# Altium schematic sheet Motor-E1.SchDoc: Motor-E1
size Letter; DocumentNumber: 3; SheetNumber: 8; SheetTotal: 11
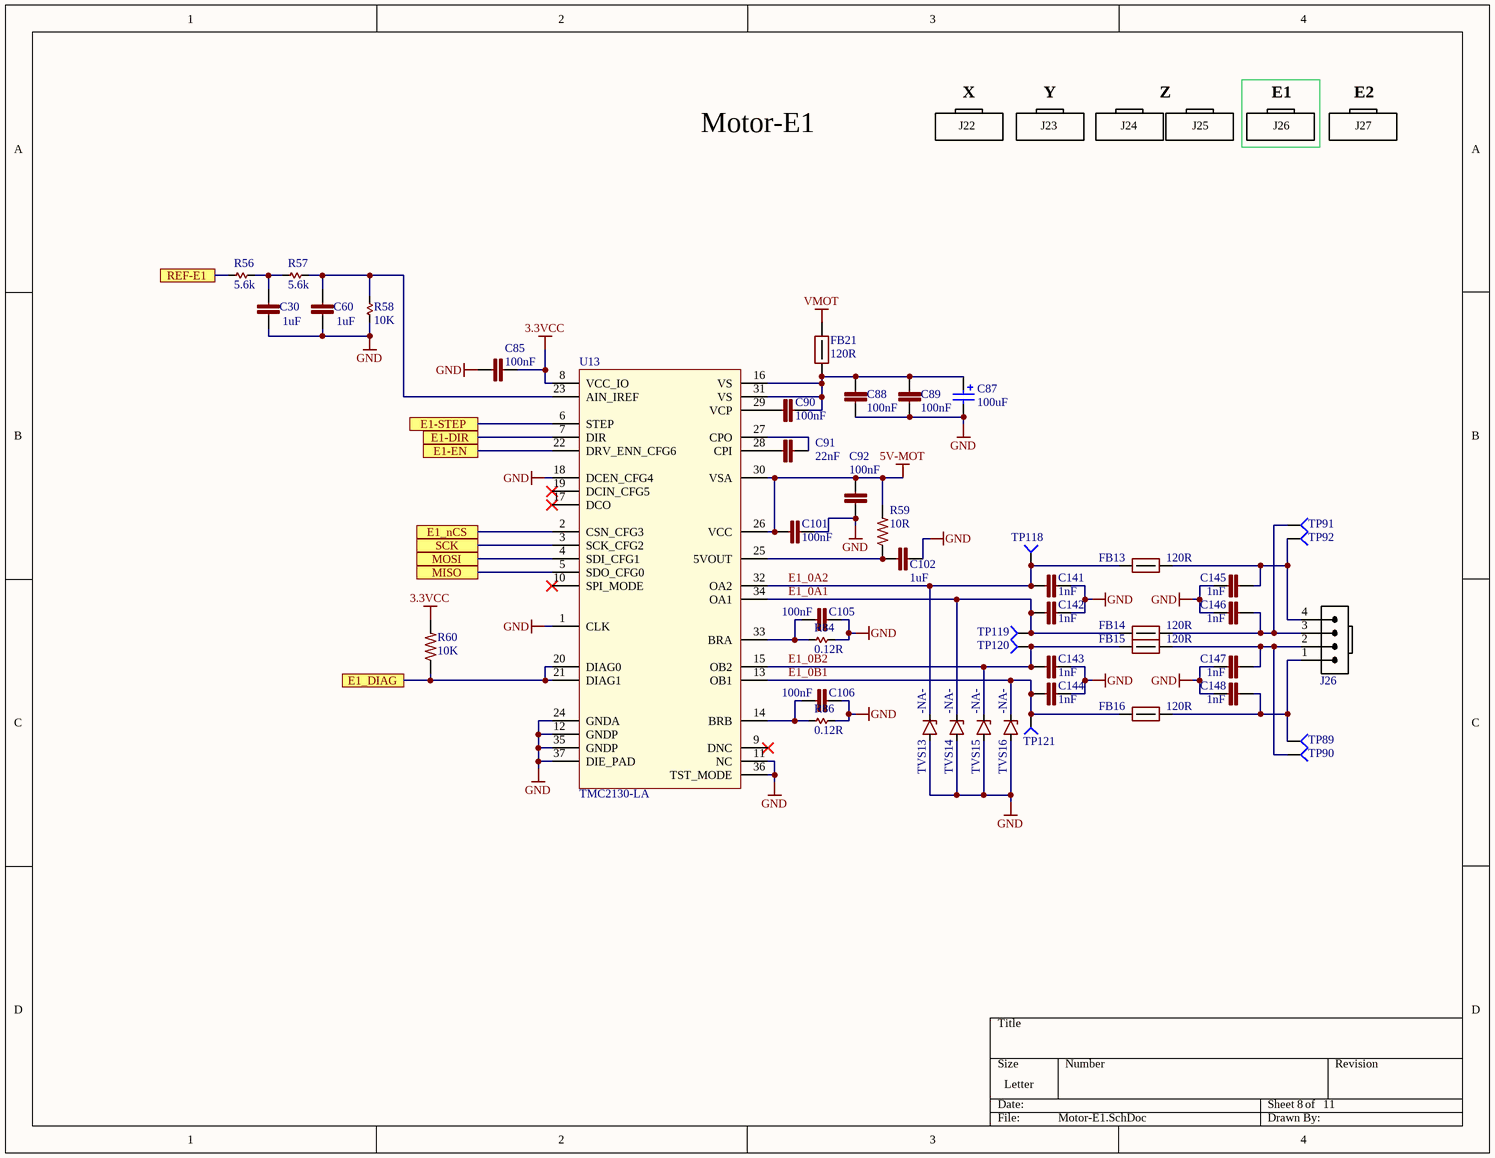
[diagram p0: Motor-E1.SchDoc]

## Parts
C30  1uF  [C0402]
C60  1uF  [C0402]
C85  100nF  [C0402]
C87  value 100uF  [CAP-ELEC-063063077]  (hidden comment: UWT1V101MCL1GS)
C88  100nF  [C0603]
C89  100nF  [C0603]
C90  100nF  [C0603]
C91  22nF  [C0402]
C92  100nF  [C0402]
C101  100nF  [C0402]
C102  1uF  [C0402]
C105  100nF  [C0603]
C106  100nF  [C0603]
C141  1nF  [C0402]
C142  1nF  [C0402]
C143  1nF  [C0402]
C144  1nF  [C0402]
C145  1nF  [C0402]
C146  1nF  [C0402]
C147  1nF  [C0402]
C148  1nF  [C0402]
FB13  120R  [FB0603]
FB14  120R  [FB0603]
FB15  120R  [FB0603]
FB16  120R  [FB0603]
FB21  120R  [FB0603]
J26  Molex 0705430038  [4POL254 PIN-IN-PASTE]  (value not drawn)
R56  5.6k  [R0402]
R57  5.6k  [R0402]
R58  10K  [R0402]
R59  10R  [R0402]
R60  10K  [R0402]
R84  0.12R  [R1206]
R86  0.12R  [R1206]
TP89  TP4  [TP-2]  (value not drawn)  (no BOM)
TP90  TP4  [TP-2]  (value not drawn)  (no BOM)
TP91  TP4  [TP-2]  (value not drawn)  (no BOM)
TP92  TP4  [TP-2]  (value not drawn)  (no BOM)
TP118  TP4  [TP-2]  (value not drawn)  (no BOM)
TP119  TP4  [TP-2]  (value not drawn)  (no BOM)
TP120  TP4  [TP-2]  (value not drawn)  (no BOM)
TP121  TP4  [TP-2]  (value not drawn)  (no BOM)
TVS13  value -NA-  [SMF]  (hidden comment: TVS 30V SMF)
TVS14  value -NA-  [SMF]  (hidden comment: TVS 30V SMF)
TVS15  value -NA-  [SMF]  (hidden comment: TVS 30V SMF)
TVS16  value -NA-  [SMF]  (hidden comment: TVS 30V SMF)
U13  TMC2130-LA  [QFN36-50P500X600X900_HS-37N]

## Ports
E1-DIR, E1-EN, E1-STEP, E1_DIAG, E1_nCS, MISO, MOSI, REF-E1, SCK

## Nets
3.3VCC: C85.1 R60.2 U13.8(VCC_IO)
5V-MOT: C92.2 C101.2 R59.2 U13.26(VCC) U13.30(VSA)
GND: C30.2 C60.2 C85.2 C87.2 C88.1 C89.1 C92.1 C101.1 C102.2 C105.1 C106.1 C141.2 C142.2 C143.2 C144.2 C145.1 C146.1 C147.1 C148.1 R58.1 R84.2 R86.2 TVS13.A TVS14.A TVS15.A TVS16.A U13.1(CLK) U13.11(NC) U13.12(GNDP) U13.18(DCEN_CFG4) U13.24(GNDA) U13.35(GNDP) U13.36(TST_MODE) U13.37(DIE_PAD)
VMOT: FB21.2
E1-DIR: U13.7(DIR) ; port E1-DIR
E1-EN: U13.22(DRV_ENN_CFG6) ; port E1-EN
E1-STEP: U13.6(STEP) ; port E1-STEP
E1_0A1: C142.1 FB14.1 TP119.1 TVS14.K U13.34(OA1)
E1_0A2: C141.1 FB13.1 TP118.1 TVS13.K U13.32(OA2)
E1_0B1: C144.1 FB16.1 TP121.1 TVS16.K U13.13(OB1)
E1_0B2: C143.1 FB15.1 TP120.1 TVS15.K U13.15(OB2)
E1_DIAG: R60.1 U13.20(DIAG0) U13.21(DIAG1) ; port E1_DIAG
E1_nCS: U13.2(CSN_CFG3) ; port E1_nCS
MISO: U13.5(SDO_CFG0) ; port MISO
MOSI: U13.4(SDI_CFG1) ; port MOSI
REF-E1: R56.1 ; port REF-E1
SCK: U13.3(SCK_CFG2) ; port SCK
NetC30_1: C30.1 R56.2 R57.1
NetC60_1: C60.1 R57.2 R58.2 U13.23(AIN_IREF)
NetC87_1: C87.1 C88.2 C89.2 C90.2 FB21.1 U13.16(VS) U13.31(VS)
NetC90_1: C90.1 U13.29(VCP)
NetC91_1: C91.1 U13.28(CPI)
NetC91_2: C91.2 U13.27(CPO)
NetC102_1: C102.1 R59.1 U13.25(5VOUT)
NetC105_2: C105.2 R84.1 U13.33(BRA)
NetC106_2: C106.2 R86.1 U13.14(BRB)
NetC145_2: C145.2 FB13.2 J26.4 TP92.1
NetC146_2: C146.2 FB14.2 J26.3 TP91.1
NetC147_2: C147.2 FB15.2 J26.2 TP90.1
NetC148_2: C148.2 FB16.2 J26.1 TP89.1

Not connected (* = marked no-connect by the designer): U13 9(DNC)* 10(SPI_MODE)* 17(DCO)* 19(DCIN_CFG5)*

## Notes on the sheet
- X
- Y
- Z
- E1
- E2
- Motor-E1
- J22
- J23
- J24
- J25
- J26
- J27

## Library data of the parts
C30 C60 = GRM155R60J105KE19D: CAP CER 0402 1uF 6.3V 10% X5R; MANUFACTURER: Murata; PART: 1uF 6.3V X5R 0402; PART DESCRIPTION: 1µF ±10% 6.3V Ceramic Capacitor X5R 0402 (1005 Metric); VALUE: 1uF; MANUFACTURER #: GRM155R60J105KE19D; DISTRIBUTOR #: 490-1320-2-ND; DISTRIBUTOR: Digi-Key Electronics; TOLERANCE: 10%; EE_SPEC: 1uF 6.3V X5R 0402
C85 C92 C101 = GRM155R71C104KA88D: CAP CER 0402 100nF 16V 10% X7R; Manufacturer: Murata; PART: 0.1uF 16V X7R 0402; Part Description: 0.10µF ±10% 16V Ceramic Capacitor X7R 0402 (1005 Metric); EE_SPEC: 100nF 16V X7R 0402; VALUE: 100nF; MANUFACTURER #: GRM155R71C104KA88D; DISTRIBUTOR #: 490-3261-2-ND; DISTRIBUTOR: Digi-Key Electronics; Tolerance: 10%
C87 = UWT1V101MCL1GS: CAP ALUM 100UF 35V 20% SMD; Manufacturer: Nichicon; PART: 100uF 35V SMD Al-El; Part Description: 100µF 35V Aluminum Capacitors Radial, Can - SMD 1000 Hrs @ 105°C; EE_SPEC: 100uF 35V Al-El; MANUFACTURER #: UWT1V101MCL1GS; DISTRIBUTOR #: 493-2203-2-ND; DISTRIBUTOR: Digi-Key Electronics; Tolerance: 20%
C88-C90 C105 C106 = C0603C104K5RACTU: CAP CER 0603 100nF 50V 10% X7R; Manufacturer: Kemet; Part Description: 0.1µF ±10% 50V Ceramic Capacitor X7R 0603 (1608 Metric); EE_SPEC: 100nF 50V X7R 0603; VALUE: 100nF; MANUFACTURER #: C0603C104K5RACTU; DISTRIBUTOR #: 399-5089-2-ND; DISTRIBUTOR: Digi-Key Electronics; PART: 100nF 50V X7R 0603; Tolerance: 10%
C91 = GCM155R71H223KA55D: CAP CER 0402 22nF ±10% 50V X7R; Manufacturer: YAGEO; Part Description: 0.022µF ±10% 50V Ceramic Capacitor X7R 0402 (1005 Metric); EE_SPEC: 22nF 50V X7R 0402; Tolerance: +/- 10%; VALUE: 22nF; MANUFACTURER #: GCM155R71H223KA55D; DISTRIBUTOR #: 490-4763-2-ND; DISTRIBUTOR: Digi-Key Electronics; PART: 22nF
C102 = GRM155R60J105KE19D: CAP CER 0402 1uF 6.3V 10% X5R; Manufacturer: Murata; Part Description: 1µF ±10% 6.3V Ceramic Capacitor X5R 0402 (1005 Metric); EE_SPEC: 1uF 6.3V X5R 0402; VALUE: 1uF; MANUFACTURER #: GRM155R60J105KE19D; DISTRIBUTOR #: 490-1320-2-ND; DISTRIBUTOR: Digi-Key Electronics; PART: 1uF 6.3V X5R 0402; Tolerance: 10%
C141-C148 = CAP 1nF 50V 0402 X7R: 1000pF 50V Ceramic Capacitor X7R 0402 (1005 Metric) 0.039" L x 0.020" W (1.00mm x 0.50mm); MANUFACTURER: Murata; MANUFACTURER #: GRM155R71H102KA01D; PART: 1nF 50V X7R 0402; PART DESCRIPTION: 1000pF ±10% 50V Ceramic Capacitor X7R 0402 (1005 Metric); TOLERANCE: 10%; VALUE: 1nF; DISTRIBUTOR #: 490-1303-2-ND; DISTRIBUTOR: Digi-Key Electronics; EE_SPEC: 50V
FB13-FB16 = FERRITE 120R 3A 0603: FERRITE BEAD 120 OHM 0603 1LN; MANUFACTURER: Samsung; MANUFACTURER #: CIS10P121AC; MANUFACTURER2#: 490-5254-2-ND; VALUE: 120Rfb; TOLERANCE: -NA-; EE_SPEC: 3A; DISTRIBUTOR #: 1276-6351-2-ND; DISTRIBUTOR: Digi-Key Electronics; PART: FERRITE 120R 3A 0603; PART DESCRIPTION: FERRITE BEAD 120 OHM 0603 1LN
FB21 = FERRITE 120R 3A 0603: FERRITE BEAD 120 OHM 0603 1LN; MANUFACTURER: Samsung; MANUFACTURER #: CIS10P121AC; VALUE: 120Rfb; TOLERANCE: -NA-; EE_SPEC: 3A; DISTRIBUTOR #: 1276-6351-2-ND; DISTRIBUTOR: Digi-Key Electronics; PART: FERRITE 120R 3A 0603; PART DESCRIPTION: FERRITE BEAD 120 OHM 0603 1LN
J26 = Molex 0705430003 PIP: Molex 4 Pin Clip Connector - Pin In Paste footprint
R56 R57 = 5.6k 1% 0402: RES SMD 5.6K OHM 1% 1/16W 0402; MANUFACTURER: YAGEO; MANUFACTURER #: RC0402FR-075K6L; PART DESCRIPTION: ±1% 0.063W, 1/16W Chip Resistor 0402 (1005 Metric) Moisture Resistant Thick Film; DISTRIBUTOR #: 311-5.6KLRTR-ND; DISTRIBUTOR: Digi-Key Electronics; PART: RES SMD 5.6K OHM 1% 1/16W 0402; TOLERANCE: 1%; EE_SPEC: 1/16W; VALUE: 5.6k
R58 = 10k 1% 0402: RES SMD 10K OHM 1% 1/16W 0402; MANUFACTURER: Yageo; MANUFACTURER #: RC0402FR-0710KP; PART DESCRIPTION: 10k Ohm ±1% 0.063W, 1/16W Chip Resistor 0402 (1005 Metric) Moisture Resistant Thick Film; DISTRIBUTOR #: YAG1249TR-ND; DISTRIBUTOR: Digi-Key Electronics; PART: 10k 1% 0402; TOLERANCE: 1%; EE_SPEC: 1/16W; VALUE: 10K
R59 = RC0402FR-0710RL: RES SMD 10 OHM 1% 1/16W 0402; Manufacturer: Yageo; Part Description: 10 Ohm ±1% 0.063W, 1/16W Chip Resistor 0402 (1005 Metric) Moisture Resistant Thick Film; EE_SPEC: 10R 1% 0402; VALUE: 10R; MANUFACTURER #: RC0402FR-0710RL; DISTRIBUTOR #: 311-10.0LRTR-ND; DISTRIBUTOR: Digi-Key Electronics; PART: 10R; Tolerance: 1%
R60 = RC0402FR-0710KP: RES SMD 10K OHM 1% 1/16W 0402; MANUFACTURER: Yageo; PART: 10k 1% 0402; PART DESCRIPTION: 10k Ohm ±1% 0.063W, 1/16W Chip Resistor 0402 (1005 Metric) Moisture Resistant Thick Film; VALUE: 10K; MANUFACTURER #: RC0402FR-0710KP; DISTRIBUTOR #: YAG1249TR-ND; DISTRIBUTOR: Digi-Key Electronics; TOLERANCE: 1%; EE_SPEC: 1/16W
R84 R86 = 0.12R 1% 1206: RES 0.12 OHM 1% 1/2W 1206; MANUFACTURER #: RL1206FR-7W0R12L; Part Description: 120 mOhms ±1% 0.5W, 1/2W Chip Resistor 1206 (3216 Metric) Automotive AEC-Q200, Current Sense, Moisture Resistant Thick Film; Tolerance: +/- 1%; DISTRIBUTOR #: 311-.12LYTR-ND; DISTRIBUTOR: Digi-Key; EE_SPEC: 0.12R 1% 1206; PART: 0.12R; VALUE: 0.12R
TP89-TP92 TP118-TP121 = Socket: MANUFACTURER #: NOTAPART-Testpoint
TVS13-TVS16 = TVS 30V SMF: TVS DIODE 30VWM 48.4VC SMF; MANUFACTURER: Vishay; MANUFACTURER #: SMF30A-E3-08; PART: TVS Diode 48.4VC; EE_SPEC: 30Vrs 48.4Vc; DISTRIBUTOR #: SMF30A-E3-08GITR-ND; DISTRIBUTOR: Digi-Key Electronics; PART DESCRIPTION: TVS DIODE 30VWM 48.4VC SMF; TOLERANCE: -NA-
U13 = TMC2130-LA-T: IC STEPPER MOTOR DVR SPI 36QFN; Manufacturer: Trinamic; Part Description: Bipolar Motor Driver Power MOSFET SPI, Step/Direction 36-QFN (5x6); EE_SPEC: 46V 1.2A 1/256 Step; Tolerance: NA; DISTRIBUTOR #: 1460-1130-2-ND; DISTRIBUTOR: Digi-Key Electronics; MANUFACTURER #: TMC2130-LA-T; PART: TMC2130; VALUE: TMC2130